# EAGLE design circuito_distanciamento_social (EAGLE 9.6.1)
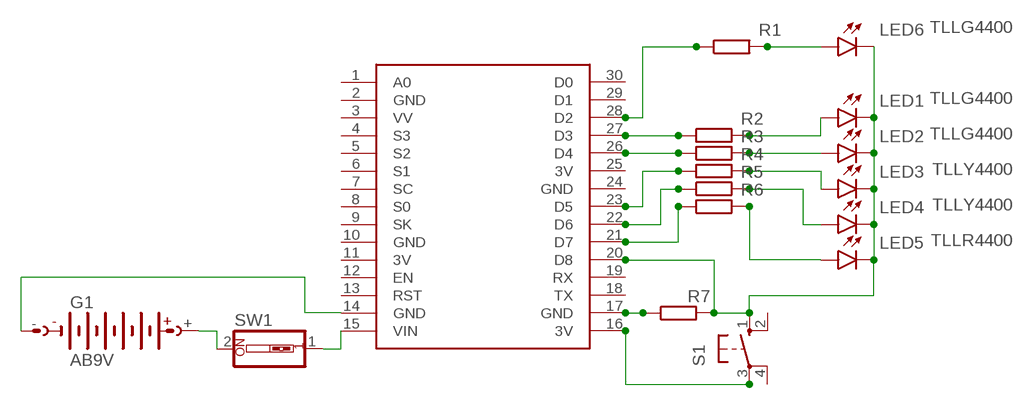
[diagram p0: schematic, sheet 1]

## Parts
G1  AB9V  [AB9V]
LED1  TLLG4400  [LED3MM]
LED2  TLLG4400  [LED3MM]
LED3  TLLY4400  [LED3MM]
LED4  TLLY4400  [LED3MM]
LED5  TLLR4400  [LED3MM]
LED6  TLLG4400  [LED3MM]
R1  R-EU_0207/10  [0207/10]
R2  R-EU_0207/10  [0207/10]
R3  R-EU_0207/10  [0207/10]
R4  R-EU_0207/10  [0207/10]
R5  R-EU_0207/10  [0207/10]
R6  R-EU_0207/10  [0207/10]
R7  R-EU_0207/10  [0207/10]
S1  10-XX  [B3F-10XX]
SW1  SW_DIP-1  [EDG-01]
U$1  NODEMCU  [NODEMCU]

## Nets
N$1: R1.1 U$1.28(D2)
N$2: LED1.K(C) LED2.K(C) LED3.K(C) LED4.K(C) LED5.K(C) LED6.K(C) R7.2 S1.1(S) U$1.20(D8)
N$3: R2.1 U$1.27(D3)
N$4: R3.1 U$1.26(D4)
N$5: R4.1 U$1.23(D5)
N$6: R5.1 U$1.22(D6)
N$7: R6.1 U$1.21(D7)
N$8: LED1.A R2.2
N$9: LED6.A R1.2
N$10: LED2.A R3.2
N$11: LED3.A R4.2
N$12: LED5.A R6.2
N$13: LED4.A R5.2
N$14: R7.1 U$1.17(GND)
N$15: G1.+ SW1.2
N$16: S1.3(P) U$1.16(3V)
N$17: G1.- U$1.14(GND)
N$18: SW1.1 U$1.15(VIN)
Unconnected: S1.2(S1) S1.4(P1) U$1.1(A0) U$1.3(VV) U$1.4(S3) U$1.5(S2) U$1.6(S1) U$1.7(SC) U$1.8(S0) U$1.9(SK) U$1.12(EN) U$1.13(RST) U$1.18(TX) U$1.19(RX) U$1.29(D1) U$1.30(D0)

## Power pins joined to a net without a drawn wire
3V: U$1.11(3V) U$1.25(3V)
GND: U$1.2(GND) U$1.10(GND) U$1.24(GND)

## Library data of the parts
G1 = battery:AB9V: 9-V BATTERY CLIP
LED1 LED2 LED6 = led:TLLG4400: Low Current (2mA) LED 3 mm Tinted Diffused Package color GREEN Source: Data sheet <http://www.farnell.com/datasheets/391098.pdf>; MF: VISHAY SEMICONDUCTOR; OC_FARNELL: 1612435
LED3 LED4 = led:TLLY4400: Low Current (2mA) LED 3 mm Tinted Diffused Package color YELLOW Source: Data sheet <http://www.farnell.com/datasheets/391098.pdf>; MF: VISHAY SEMICONDUCTOR; OC_FARNELL: 1612439
LED5 = led:TLLR4400: Low Current (2mA) LED 3 mm Tinted Diffused Package color RED Source: Data sheet <http://www.farnell.com/datasheets/391100.pdf>; MF: VISHAY SEMICONDUCTOR; OC_FARNELL: 1612437
R1-R7 = rcl:R-EU_: RESISTOR, European symbol; SPICEPREFIX: R
S1 = switch-omron:10-XX: OMRON SWITCH; MPN: B3F-1000; OC_FARNELL: 176432; OC_NEWARK: 36M3542
SW1 = special:SW_DIP-1: DIP SWITCH
U$1 = nodemcu:NODEMCU

## Board
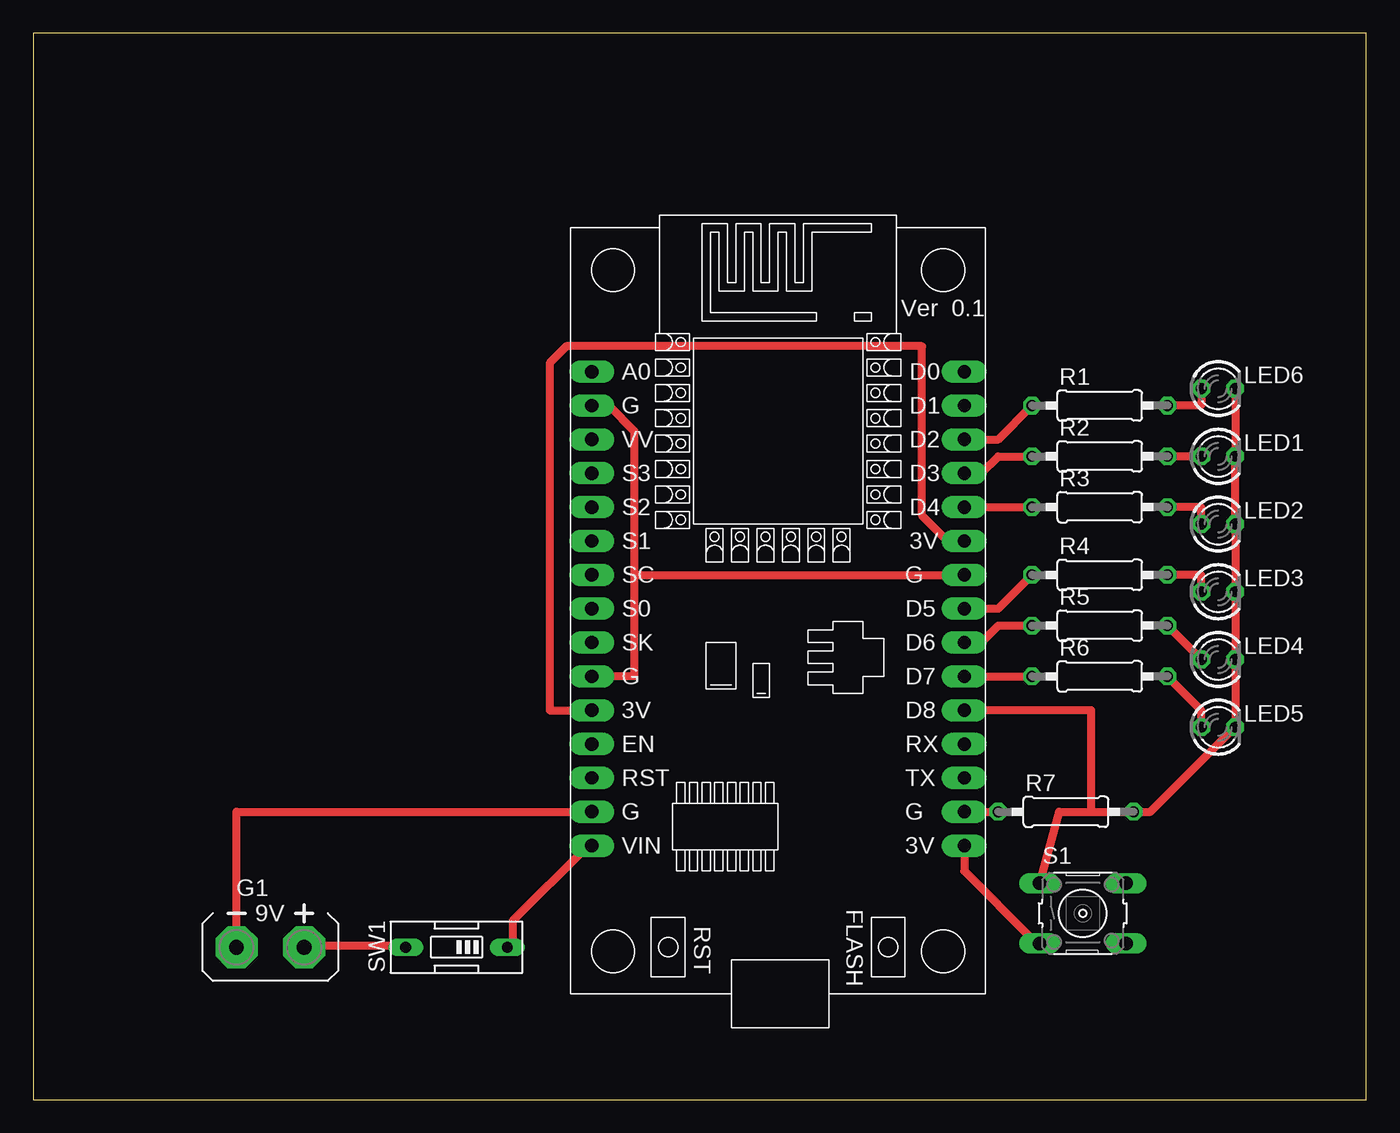
[diagram p1: board, top side]

Size 100 x 80 mm. Coordinates in mm from the lower left corner, seen from the top.
Outline: 0,0 100,0 100,80 0,80 0,0
Copper layers (1*16): Top 0.035mm / dielectric 1.5mm / Bottom 0.035mm
Design rules "default *": minimum track width 24mil, minimum drill 0.35mm, track to track 24mil, track to pad 24mil, pad to pad 24mil, via to via 24mil, smd to smd 6mil, copper to edge 40mil, drill to drill 24mil, minimum pad ring 10mil, minimum via ring 8mil, stop-mask expansion 4mil, vias tented up to drill 0mil, thermal gap 10mil

### Footprints (pad centres in the part's own frame; a part is rotated, then mirrored left to right if it is on the bottom)
AB9V = drill 1.118 pad 3.15 octagon: + 0,2.54; - 0,-2.54
LED3MM = drill 0.813 octagon: A -1.27,0; K 1.27,0
0207/10 = drill 0.813 octagon: 1 -5.08,0; 2 5.08,0
B3F-10XX = drill 1.016 long: 1 -3.251,2.261; 2 3.251,2.261; 3 -3.251,-2.261; 4 3.251,-2.261
EDG-01 = drill 0.813 long: 1 0,-3.81; 2 0,3.81
NODEMCU = drill 1 pad 1.676 long: 1 -13.97,17.78; 2 -13.97,15.24; 3 -13.97,12.7; 4 -13.97,10.16; 5 -13.97,7.62; 6 -13.97,5.08; 7 -13.97,2.54; 8 -13.97,0; 9 -13.97,-2.54; 10 -13.97,-5.08; 11 -13.97,-7.62; 12 -13.97,-10.16; 13 -13.97,-12.7; 14 -13.97,-15.24; 15 -13.97,-17.78; 16 13.97,-17.78; 17 13.97,-15.24; 18 13.97,-12.7; 19 13.97,-10.16; 20 13.97,-7.62; 21 13.97,-5.08; 22 13.97,-2.54; 23 13.97,0; 24 13.97,2.54; 25 13.97,5.08; 26 13.97,7.62; 27 13.97,10.16; 28 13.97,12.7; 29 13.97,15.24; 30 13.97,17.78

### Placement (x,y rotation side)
G1  17.78,11.43 270 top
LED1  88.9,48.26 0 top
LED2  88.9,43.18 0 top
LED3  88.9,38.1 0 top
LED4  88.9,33.02 0 top
LED5  88.9,27.94 0 top
LED6  88.9,53.34 0 top
R1  80.01,52.07 0 top
R2  80.01,48.26 0 top
R3  80.01,44.45 0 top
R4  80.01,39.37 0 top
R5  80.01,35.56 0 top
R6  80.01,31.75 0 top
R7  77.47,21.59 0 top
S1  78.74,13.97 0 top
SW1  31.75,11.43 90 top
U$1  55.88,36.83 0 top

### Tracks (layer width: path | path; a pad name or v marks a point on that pad's centre or on a via)
3V
  Top 0.61: U$1.11 38.73,29.21 38.73,55.24 40.01,56.52 66.67,56.52 66.67,43.81 68.58,41.91 U$1.25
GND
  Top 0.61: U$1.10 45.09,31.75 45.09,39.37 | 45.09,39.37 45.09,50.16 43.18,52.07 U$1.2 | 45.09,39.37 U$1.24
N$1
  Top 0.61: R1.1 72.39,49.53 U$1.28
N$2
  Top 0.61: LED6.K LED1.K LED2.K LED3.K LED4.K LED5.K 83.82,21.59 R7.2 79.38,21.59 | 76.95,21.59 79.38,21.59 | 76.95,21.59 | 76.95,21.59 S1.1 | U$1.20 79.38,29.21 79.38,21.59
N$3
  Top 0.61: R2.1 72.39,48.26 71.12,46.99 U$1.27
N$4
  Top 0.61: U$1.26 R3.1
N$5
  Top 0.61: R4.1 72.39,36.83 U$1.23
N$6
  Top 0.61: R5.1 72.39,35.56 71.12,34.29 U$1.22
N$7
  Top 0.61: U$1.21 R6.1
N$8
  Top 0.61: LED1.A R2.2
N$9
  Top 0.61: R1.2 87.63,52.07 LED6.A
N$10
  Top 0.61: R3.2 87.63,44.45 LED2.A
N$11
  Top 0.61: R4.2 87.63,39.37 LED3.A
N$12
  Top 0.61: R6.2 87.63,29.21 LED5.A
N$13
  Top 0.61: LED4.A R5.2
N$14
  Top 0.61: U$1.17 R7.1
N$15
  Top 0.61: SW1.2 27.43,11.58 20.73,11.58 G1.+
N$16
  Top 0.61: U$1.16 69.85,17.14 74.93,12.06 S1.3
N$17
  Top 0.61: U$1.14 15.24,21.59 G1.-
N$18
  Top 0.61: SW1.1 35.97,11.58 35.97,13.41 41.45,18.9 U$1.15